# EAGLE schematic RotorPSU (EAGLE 9.5.0)
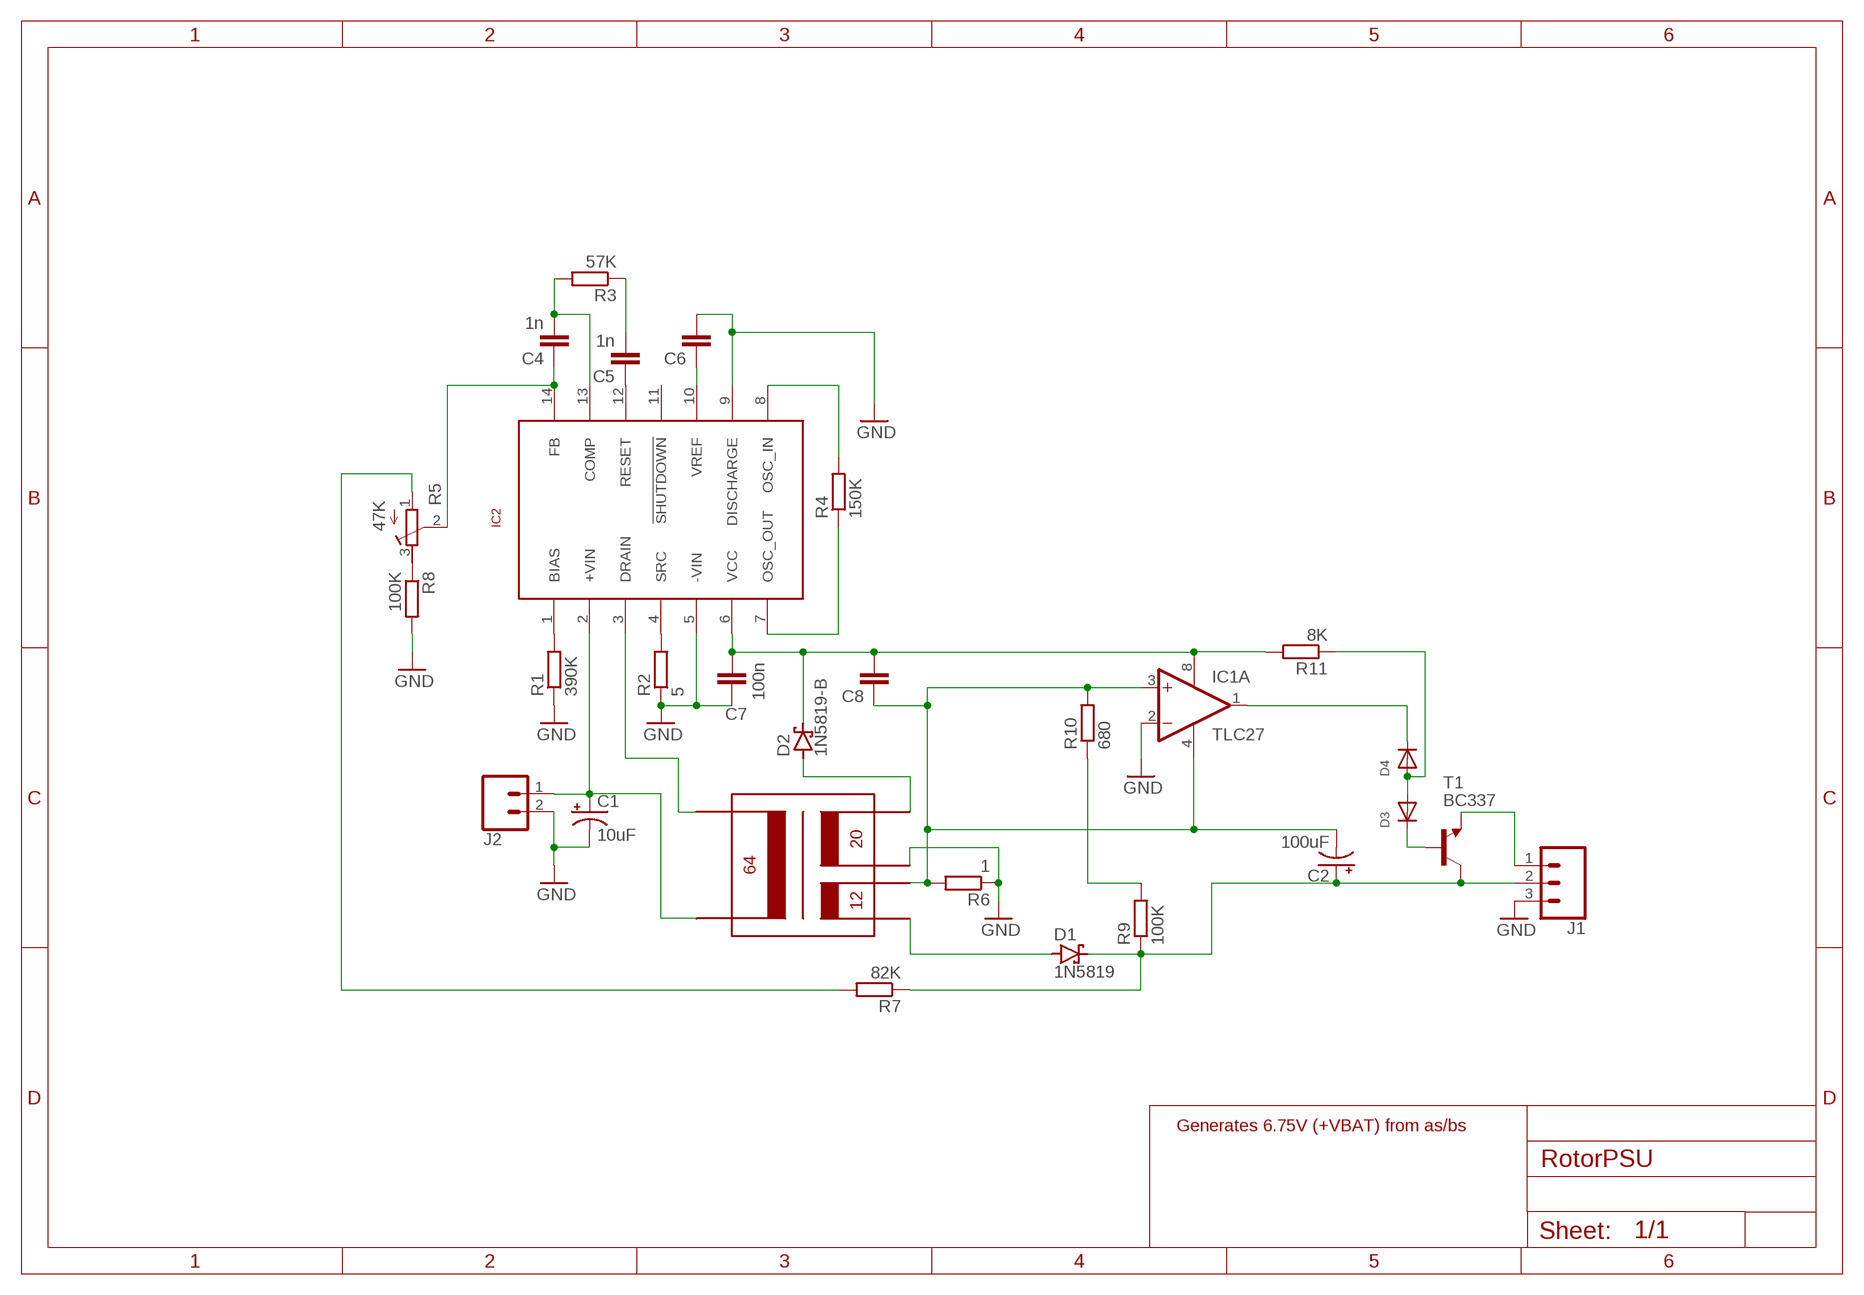
[diagram p0: schematic, sheet 1]

## Parts
C1  10uF  10UF-POLAR-RADIAL-2.5MM-25V-20%  [CPOL-RADIAL-2.5MM-5MM]
C2  100uF  100UF-POLAR-RADIAL-2.5MM-25V-20%  [CPOL-RADIAL-2.5MM-6.5MM]
C4  1n  C-EU025-025X050  [C025-025X050]
C5  1n  C-EU025-025X050  [C025-025X050]
C6  C-EU025-025X050  [C025-025X050]
C7  100n  C-EU025-025X050  [C025-025X050]
C8  C-EU025-025X050  [C025-025X050]
D1  1N5819  1N5819-B  [DO41-7.6]
D2  1N5819-B  [DO41-7.6]
D3  DIODEDO-1N4148  [DO-1N4148]
D4  DIODEDO-1N4148  [DO-1N4148]
IC1  TLC27  TLC27L2ACP  [DIL08]
IC2  SI9100  [DIL14]
J1  CONN_03  [1X03]
J2  CONN_02  [1X02]
R1  390K  R-EU_0207/7  [0207/7]
R2  5  R-EU_0207/7  [0207/7]
R3  57K  R-EU_0207/7  [0207/7]
R4  150K  R-EU_0207/7  [0207/7]
R5  47K  R-TRIMM3296W  [RTRIM3296W]
R6  1  R-EU_0207/7  [0207/7]
R7  82K  R-EU_0207/7  [0207/7]
R8  100K  R-EU_0207/7  [0207/7]
R9  100K  R-EU_0207/7  [0207/7]
R10  680  R-EU_0207/7  [0207/7]
R11  8K  R-EU_0207/7  [0207/7]
T1  BC337  [TO92]
TR1  ROTOR_XFORMER  [ROTOR_XFORMER]

## Nets
GND: C1.2(-) C6.2 C7.1 IC1.2(A:-IN) IC2.5(-VIN) IC2.9(DISCHARGE) J1.3 J2.2 R1.1 R2.1 R6.1 R8.2 TR1.P$8(20A)
N$1: C4.1 IC2.14(FB) R5.2(S)
N$2: C4.2 IC2.13(COMP) R3.2
N$3: IC2.1(BIAS) R1.2
N$4: C1.1(+) IC2.2(+VIN) J2.1 TR1.P$2(64A)
N$5: IC2.4(SRC) R2.2
N$6: C5.1 IC2.12(RESET)
N$7: C5.2 R3.1
N$8: IC2.8(OSC_IN) R4.2
N$9: IC2.7(OSC_OUT) R4.1
N$10: C6.1 IC2.10(VREF)
N$11: IC2.3(DRAIN) TR1.P$4(64B)
N$12: C7.2 C8.2 D2.C IC1.8(C:VDD) IC2.6(VCC) R11.2
N$13: D2.A TR1.P$3(20B)
N$14: D1.A TR1.P$6(12A)
N$15: C2.1(+) D1.C J1.2 R7.1 R9.1 T1.3(C)
N$16: C2.2(-) C8.1 IC1.3(A:+IN) IC1.4(C:GND) R6.2 R10.2 TR1.P$7(12B)
N$17: R5.3(E) R8.1
N$18: R5.1(A) R7.2
N$19: R9.2 R10.1
N$20: J1.1 T1.1(E)
N$21: D3.C T1.2(B)
N$22: D3.A D4.A R11.1
N$24: D4.C IC1.1(A:OUT)
Unconnected: IC1.5(B:+IN) IC1.6(B:-IN) IC1.7(B:OUT) IC2.11(!SHUTDOWN)

## Notes on the sheet
- Generates 6.75V (+VBAT) from as/bs

## Library data of the parts
C1 = SparkFun-Capacitors:10UF-POLAR: 10.0µF polarized capacitors A capacitor is a passive two-terminal electrical component used to store electrical energy temporarily in an electric field.; PROD_ID: CAP-08440
C2 = SparkFun-Capacitors:100UF-POLAR: 100µF polarized capacitors A capacitor is a passive two-terminal electrical component used to store electrical energy temporarily in an electric field.; PROD_ID: CAP-08439
C4-C8 = resistor:C-EU: CAPACITOR, European symbol
D1 D2 = diode:1N581*: 1.0A SCHOTTKY BARRIER RECTIFIER Source: http://www.diodes.com/datasheets/ds23001.pdf
D3 D4 = adafruit:DIODE: Diode SMADIODE - SMA Surface Mount Package 20V 1A Schottky Diode Digikey: 641-1014-6-ND DO-1N4148 - Through Hole Small Current Diode SOD-123 20V 1 A (.5mV Vf) Schottky Diode - Digikey: MBRX120TPMSCT-ND SOD-323 10V 570mA (.38mV Vf, 3ns) Schottky Diode - Digikey: ZLLS410CT-ND SOD-523 30V 30mA Schottky Diode (RB751S-40TE61) - Digikey: RB751S-40TE61CT-ND SOT23-R/W - SOT23 Package (R = Solder Paste/Reflow Ovens, W = Hand-Soldering) BAT54Film 40V 300mA - Digikey: 497-7162-1-ND
IC1 = linear:TLC27L*: LinCMOS(TM) PRECISION DUAL OPERATIONAL AMPLIFIERS Source: http://focus.ti.com/lit/ds/symlink/tlc27l2.pdf
IC2 = special:SI9100
J1 = SparkFun-Connectors:CONN_03: Multi connection point. Often used as Generic Header-pin footprint for 0.1 inch spaced/style header connections On any of the 0.1 inch spaced packages, you can populate with these: Break Away Headers - Straight <https://www.sparkfun.com/products/116> (PRT-00116) Break Away Male Headers - Right Angle <https://www.sparkfun.com/products/553> (PRT-00553) Female Headers <https://www.sparkfun.com/products/115> (PRT-00115) Break Away Headers - Machine Pin <https://www.sparkfun.com/products/117> (PRT-00117) Break Away Female Headers - Swiss Machine Pin <https://www.sparkfun.com/products/743> (PRT-00743) Stackable Header - 3 Pin (Female, 0.1") <https://www.sparkfun.com/products/13875> (PRT-13875) For SCREWTERMINALS and SPRING TERMINALS visit here: Screw Terimnals on SparkFun.com <https://www.sparkfun.com/search/results?term=Screw+Terminals> (5mm/3.5mm/2.54mm spacing) This device is also useful as a general connection point to wire up your design to another part of your project. Our various solder wires solder well into these plated through hole pads. Hook-Up Wire - Assortment (Stranded, 22 AWG) <https://www.sparkfun.com/products/11375> (PRT-11375) Hook-Up Wire - Assortment (Solid Core, 22 AWG) <https://www.sparkfun.com/products/11367> (PRT-11367) View the entire wire category on our website here <https://www.sparkfun.com/categories/141> Special notes: Molex polarized connector foot print use with SKU : PRT-08232 with associated crimp pins and housings.
J2 = SparkFun-Connectors:CONN_02: Multi connection point. Often used as Generic Header-pin footprint for 0.1 inch spaced/style header connections On any of the 0.1 inch spaced packages, you can populate with these: Break Away Headers - Straight <https://www.sparkfun.com/products/116> (PRT-00116) Break Away Male Headers - Right Angle <https://www.sparkfun.com/products/553> (PRT-00553) Female Headers <https://www.sparkfun.com/products/115> (PRT-00115) Break Away Headers - Machine Pin <https://www.sparkfun.com/products/117> (PRT-00117) Break Away Female Headers - Swiss Machine Pin <https://www.sparkfun.com/products/743> (PRT-00743) For SCREWTERMINALS and SPRING TERMINALS visit here: Screw Terimnals on SparkFun.com <https://www.sparkfun.com/search/results?term=Screw+Terminals> (5mm/3.5mm/2.54mm spacing) This device is also useful as a general connection point to wire up your design to another part of your project. Our various solder wires solder well into these plated through hole pads. Hook-Up Wire - Assortment (Stranded, 22 AWG) <https://www.sparkfun.com/products/11375> (PRT-11375) Hook-Up Wire - Assortment (Solid Core, 22 AWG) <https://www.sparkfun.com/products/11367> (PRT-11367) View the entire wire category on our website here <https://www.sparkfun.com/categories/141> Special notes: Molex polarized connector foot print use with: PRT-08233 with associated crimp pins and housings. 2.54_SCREWTERM for use with PRT-10571. 3.5mm Screw Terminal footprints for PRT-08084 5mm Screw Terminal footprints for use with PRT-08432
R1-R4 R6-R11 = resistor:R-EU_: RESISTOR, European symbol
R5 = resistor:R-TRIMM: Trimm resistor
T1 = transistor:BC337: NPN TRANSISTOR
TR1 = special:ROTOR_XFORMER